# EAGLE design SH-SwitchNode-CT1 (EAGLE 7.2.0)
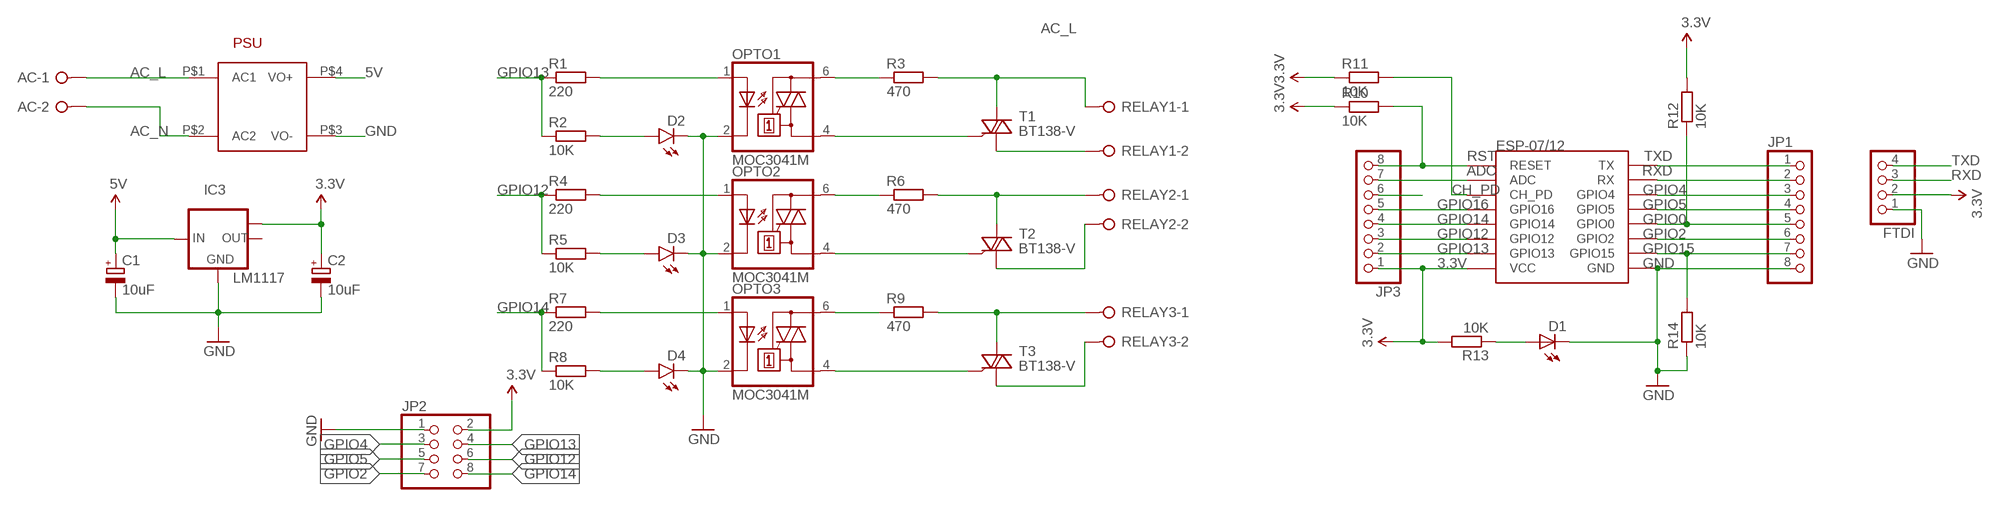
[diagram p0: schematic, sheet 1]

## Parts
AC  W237-02P  [W237-132]
C1  10uF  CPOL-EUB/3528-21W  [B/3528-21W]
C2  10uF  CPOL-EUB/3528-21W  [B/3528-21W]
D1  LEDCHIPLED_0805  [CHIPLED_0805]
D2  LED3MM  [LED3MM]
D3  LED3MM  [LED3MM]
D4  LED3MM  [LED3MM]
ESP-07/12  ESP12SMD  [ESP12-SMD]
FTDI  PINHD-1X4  [1X04]
IC3  LM1117  LM1117MPX-3.3  [SOT223]
JP1  PINHD-1X8  [1X08]
JP2  PINHD-2X4  [2X04]
JP3  PINHD-1X8  [1X08]
OPTO1  MOC3041M  [DIL06]
OPTO2  MOC3041M  [DIL06]
OPTO3  MOC3041M  [DIL06]
PSU  HLK-PM01  [HLK-PM01]
R1  220  R-EU_R0805  [R0805]
R2  10K  R-EU_R0805  [R0805]
R3  470  R-EU_R0805  [R0805]
R4  220  R-EU_R0805  [R0805]
R5  10K  R-EU_R0805  [R0805]
R6  470  R-EU_R0805  [R0805]
R7  220  R-EU_R0805  [R0805]
R8  10K  R-EU_R0805  [R0805]
R9  470  R-EU_R0805  [R0805]
R10  10K  R-EU_R0805  [R0805]
R11  10K  R-EU_R0805  [R0805]
R12  10K  R-EU_R0805  [R0805]
R13  10K  R-EU_R0805  [R0805]
R14  10K  R-EU_R0805  [R0805]
RELAY1  W237-02P  [W237-132]
RELAY2  W237-02P  [W237-132]
RELAY3  W237-02P  [W237-132]
T1  BT138-V  [TO220BV]
T2  BT138-V  [TO220BV]
T3  BT138-V  [TO220BV]

## Nets
3.3V: C2.+ ESP-07/12.VCC FTDI.2 IC3.TAB(OUT1) JP2.2 JP3.1 R10.1 R11.1 R12.2 R13.2
5V: C1.+ IC3.3(IN) PSU.P$4(VO+)
AC_L: AC.1 PSU.P$1(AC1) R3.2 R6.2 R9.2 RELAY1.1 RELAY2.1 RELAY3.1 T1.T2(A2) T2.T2(A2) T3.T2(A2)
AC_N: AC.2 PSU.P$2(AC2)
ADC: ESP-07/12.ADC JP3.7
CH_PD: ESP-07/12.CH_PD JP3.6 R11.2
GND: C1.- C2.- D1.C D2.K(C) D3.K(C) D4.K(C) ESP-07/12.GND FTDI.1 IC3.1(GND) JP1.8 JP2.1 OPTO1.2(C) OPTO2.2(C) OPTO3.2(C) PSU.P$3(VO-) R14.1
GPIO0: ESP-07/12.GPIO0 JP1.5 R12.1
GPIO2: ESP-07/12.GPIO2 JP1.6 JP2.7
GPIO4: ESP-07/12.GPIO4 JP1.3 JP2.3
GPIO5: ESP-07/12.GPIO5 JP1.4 JP2.5
GPIO12: ESP-07/12.GPIO12 JP2.6 JP3.3 R4.1 R5.1
GPIO13: ESP-07/12.GPIO13 JP2.4 JP3.2 R1.1 R2.1
GPIO14: ESP-07/12.GPIO14 JP2.8 JP3.4 R7.1 R8.1
GPIO15: ESP-07/12.GPIO15 JP1.7 R14.2
GPIO16: ESP-07/12.GPIO16 JP3.5
N$1: OPTO1.1(A) R1.2
N$4: OPTO1.6(A2) R3.1
N$6: OPTO2.1(A) R4.2
N$7: D3.A R5.2
N$9: OPTO2.6(A2) R6.1
N$10: OPTO1.4(A1) T1.G
N$11: OPTO2.4(A1) T2.G
N$12: OPTO3.1(A) R7.2
N$13: D4.A R8.2
N$14: RELAY2.2 T2.T1(A1)
N$15: OPTO3.6(A2) R9.1
N$16: OPTO3.4(A1) T3.G
N$17: RELAY3.2 T3.T1(A1)
N$18: D2.A R2.2
N$19: RELAY1.2 T1.T1(A1)
N$25: D1.A R13.1
RST: ESP-07/12.RESET JP3.8 R10.2
RXD: ESP-07/12.RXD0(RX) FTDI.3 JP1.2
TXD: ESP-07/12.TXD0(TX) FTDI.4 JP1.1
Unconnected: IC3.2(OUT)

## Library data of the parts
AC RELAY1-RELAY3 = con-wago-508:W237-02P: WAGO SREW CLAMP; OC_FARNELL: unknown; OC_NEWARK: unknown
C1 C2 = rcl:CPOL-EU: POLARIZED CAPACITOR, European symbol
D1 = adafruit:LED: LED OSRAM: - CHIPLED LG R971, LG N971, LY N971, LG Q971, LY Q971, LO R971, LY R971 LH N974, LH R974 LS Q976, LO Q976, LY Q976 LO Q996 - Hyper CHIPLED LW Q18S LB Q993, LB Q99A, LB R99A - SideLED LS A670, LO A670, LY A670, LG A670, LP A670 LB A673, LV A673, LT A673, LW A673 LH A674 LY A675 LS A676, LA A676, LO A676, LY A676, LW A676 LS A679, LY A679, LG A679 - Hyper Micro SIDELED® LS Y876, LA Y876, LO Y876, LY Y876 LT Y87S - SmartLED LW L88C, LW L88S LB L89C, LB L89S, LG L890 LS L89K, LO L89K, LY L89K LS L896, LA L896, LO L896, LY L896 - TOPLED LS T670, LO T670, LY T670, LG T670, LP T670 LSG T670, LSP T670, LSY T670, LOP T670, LYG T670 LG T671, LOG T671, LSG T671 LB T673, LV T673, LT T673, LW T673 LH T674 LS T676, LA T676, LO T676, LY T676, LB T676, LH T676, LSB T676, LW T676 LB T67C, LV T67C, LT T67C, LS T67K, LO T67K, LY T67K, LW E67C LS E67B, LA E67B, LO E67B, LY E67B, LB E67C, LV E67C, LT E67C LW T67C LS T679, LY T679, LG T679 LS T770, LO T770, LY T770, LG T770, LP T770 LB T773, LV T773, LT T773, LW T773 LH T774 LS E675, LA E675, LY E675, LS T675 LS T776, LA T776, LO T776, LY T776, LB T776 LHGB T686 LT T68C, LB T68C - Hyper Mini TOPLED® LB M676 - Mini TOPLED Santana® LG M470 LS M47K, LO M47K, LY M47K Source: http://www.osram.convergy.de/
D2-D4 = SparkFun-LED:LED: LEDs Standard schematic elements and footprints for 5mm, 3mm, 1206, and 0603 sized LEDs. 5mm - Spark Fun Electronics SKU : COM-00529 (and others)
ESP-07/12 = esp8266modules:ESP12: ESP8266 Wifi module 12
FTDI = pinhead:PINHD-1X4: PIN HEADER
IC3 = lm1117:LM1117MPX-*
JP1 JP3 = pinhead:PINHD-1X8: PIN HEADER
JP2 = adafruit:PINHD-2X4: PIN HEADER
OPTO1-OPTO3 = optocoupler:MOC30*: 6-Pin DIP Zero-Cross Optoisolators Triac Driver Output (250/400 Volt Peak) Source: Data sheet <http://www.fairchildsemi.com/ds/MO/MOC3031M.pdf> The old path of data sheet not more available 2013-05-06.; MF: FAIRCHILD SEMICONDUCTOR; MPN: MOC3041M; OC_FARNELL: 1086677; OC_NEWARK: 78K6090
PSU = HLK-PM01-Exported:HLK-PM01: HI-LINK Ultra-compact power module HLK-PM01 Meet UL, CE requirements Ultra-thin, ultra-small All voltage input (AC: 90 ~ 264V) Low ripple and low noise Output overload and short circuit protection High efficiency, high power density The product is designed to meet the requirements of EMC and Safety Test Low power consumption, environmental protection, no-load loss <0.1W 100% load aging and testing
R1-R14 = rcl:R-EU_: RESISTOR, European symbol
T1-T3 = triac:BT138: TRIAC Source: http://www.semiconductors.philips.com BT138_SERIES_2.pdf

## Board
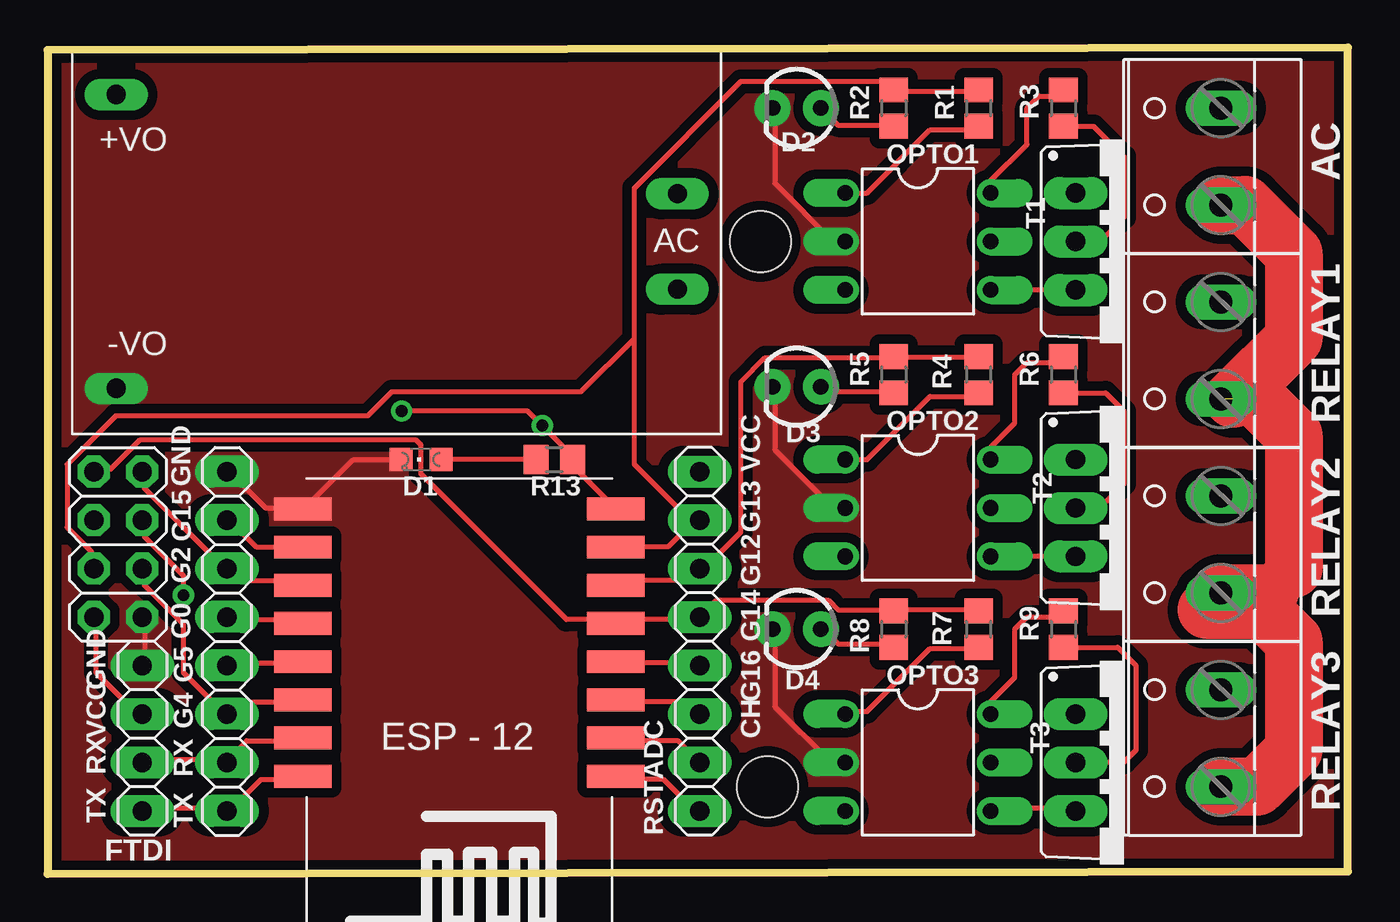
[diagram p1: board, top side]
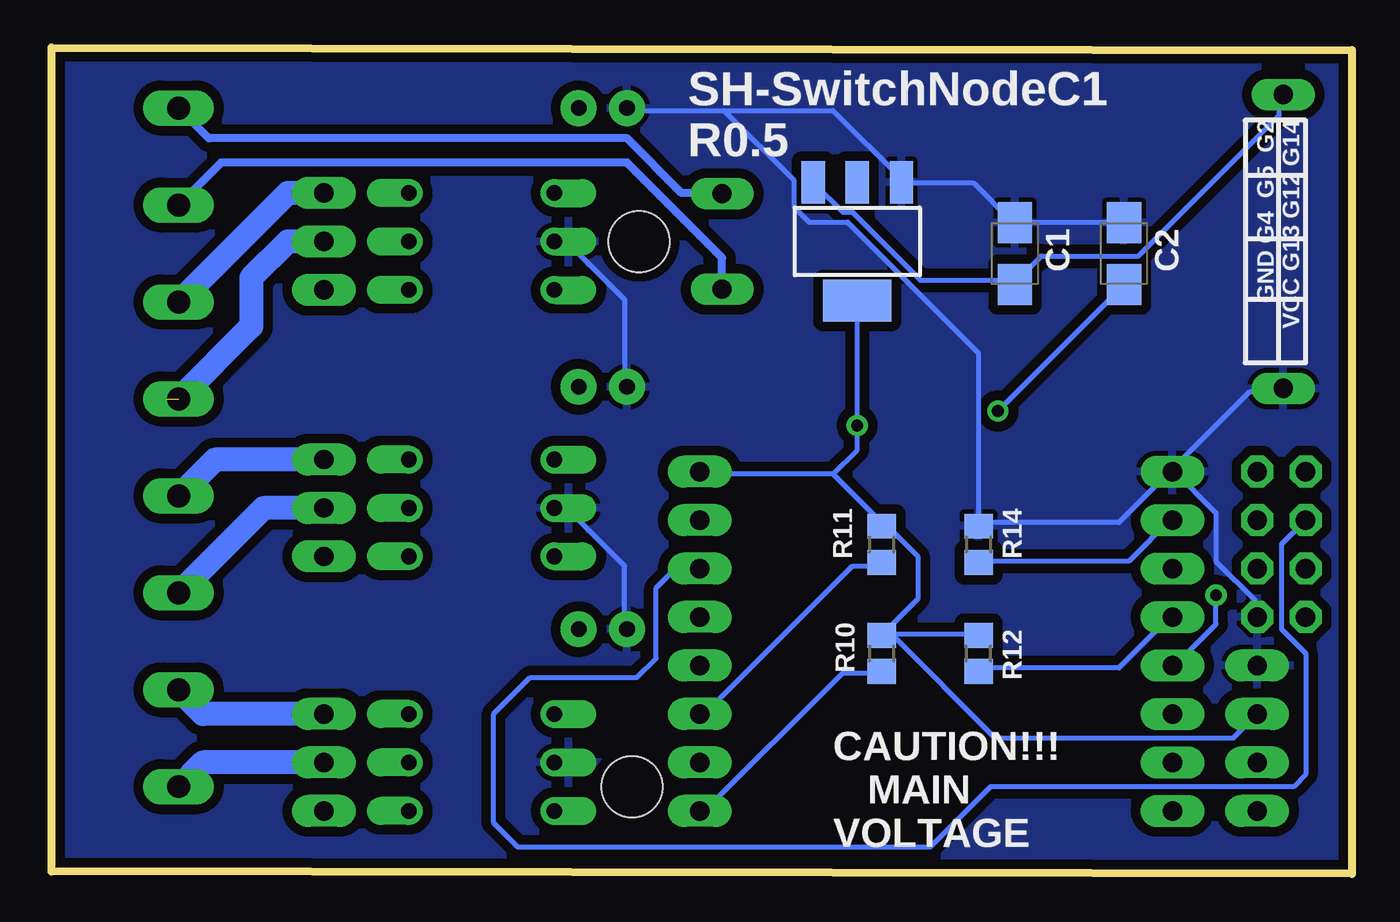
[diagram p2: board, bottom side, seen from below]

Size 68.12 x 43.3 mm. Coordinates in mm from the lower left corner, seen from the top.
Outline: 0,0 68.12,0.13 68.12,43.3 0,43.17 0,0
Copper layers (1*16): Top 0.035mm / dielectric 1.5mm / Bottom 0.035mm
Design rules "default *": minimum track width 10mil, minimum drill 24mil, track to track 10mil, track to pad 10mil, pad to pad 10mil, via to via 10mil, smd to smd 8mil, copper to edge 20mil, drill to drill 12mil, minimum pad ring 13mil, minimum via ring 10mil, stop-mask expansion 4mil, vias tented up to drill 0mil, thermal gap 10mil
Holes 3.2 mm at 37.34,33.15 37.72,4.57

### Footprints (pad centres in the part's own frame; a part is rotated, then mirrored left to right if it is on the bottom)
W237-132 = drill 1.194 long: 1 -2.54,-0.635; 2 2.54,-0.635
B/3528-21W = smd 2.15 x 1.8: + 1.625,0; - -1.625,0
CHIPLED_0805 = smd 1.2 x 1.2: A 0,-1.05; C 0,1.05
LED3MM = drill 0.813 pad 1.88: A -1.27,0; K 1.27,0
ESP12-SMD = smd 3 x 1.2: ADC -8.3,3.8; CH_PD -8.3,1.8; GND 8.1,-8.2; GPIO0 8.1,-2.2; GPIO2 8.1,-4.2; GPIO4 8.1,1.8; GPIO5 8.1,-0.2; GPIO12 -8.3,-4.2; GPIO13 -8.3,-6.2; GPIO14 -8.3,-2.2; GPIO15 8.1,-6.2; GPIO16 -8.3,-0.2; RESET -8.3,5.8; RXD0 8.1,3.8; TXD0 8.1,5.8; VCC -8.3,-8.2
1X04 = drill 1.016 long: 1 -3.81,0; 2 -1.27,0; 3 1.27,0; 4 3.81,0
SOT223 = smd 1.219 x 2.235: 1 -2.311,-3.099; 2 0,-3.099; 3 2.311,-3.099 | smd 3.6 x 2.2: TAB 0,3.099
1X08 = drill 1.016 long: 1 -8.89,0; 2 -6.35,0; 3 -3.81,0; 4 -1.27,0; 5 1.27,0; 6 3.81,0; 7 6.35,0; 8 8.89,0
2X04 = drill 1.016 pad 1.676 octagon: 1 -3.81,-1.27; 2 -3.81,1.27; 3 -1.27,-1.27; 4 -1.27,1.27; 5 1.27,-1.27; 6 1.27,1.27; 7 3.81,-1.27; 8 3.81,1.27
DIL06 = drill 0.813 offset: 1 -2.54,-3.81; 2 0,-3.81; 3 2.54,-3.81; 4 2.54,3.81; 5 0,3.81; 6 -2.54,3.81
HLK-PM01 = drill 1 long: P$1 -14.7,2.5; P$2 -14.7,-2.5; P$3 14.7,7.7; P$4 14.7,-7.7
R0805 = smd 1.3 x 1.5: 1 -0.95,0; 2 0.95,0
TO220BV = drill 1.016 long: G 2.54,-2.54; T1 -2.54,-2.54; T2 0,-2.54

### Placement (x,y rotation side)
AC  60.83,37.59 90 top
C1  17.65,32.51 270 bottom
C2  11.94,32.51 270 bottom
D1  19.56,21.72 90 top
D2  39.24,40.13 180 top
D3  39.24,25.53 180 top
D4  39.24,12.83 180 top
ESP-07/12  21.46,10.92 180 top
FTDI  4.95,7.11 270 top
IC3  25.91,33.15 180 bottom
JP1  9.4,12.19 90 top
JP2  3.68,17.27 90 top
JP3  34.16,12.19 270 top
OPTO1  45.59,33.15 270 top
OPTO2  45.59,19.18 270 top
OPTO3  45.59,5.84 270 top
PSU  18.29,33.15 180 top
R1  48.77,40.13 270 top
R2  44.32,40.13 270 top
R3  53.21,40.13 270 top
R4  48.77,26.16 270 top
R5  44.32,26.16 270 top
R6  53.21,26.16 270 top
R7  48.77,12.83 270 top
R8  44.32,12.83 270 top
R9  53.21,12.83 270 top
R10  24.64,11.56 270 bottom
R11  24.64,17.27 270 bottom
R12  19.56,11.56 90 bottom
R13  26.54,21.72 0 top
R14  19.56,17.27 270 bottom
RELAY1  60.83,27.43 90 top
RELAY2  60.83,17.27 90 top
RELAY3  60.83,7.11 90 top
T1  56.39,33.15 270 top
T2  56.39,19.18 270 top
T3  56.39,5.84 270 top

### Tracks (layer width: path | path; a pad name or v marks a point on that pad's centre or on a via)
3.3V  (via drill 0.61)
  Top 0.254: 27.69,21.72 27.69,21.21 29.72,19.18 ESP-07/12.VCC | v18.54,24.26 25.15,24.26 v25.91,23.49 27.69,21.72 | 27.69,21.72 R13.2 | JP2.2 2.54,13.34 2.54,10.54 4.83,8.26 FTDI.2
  Bottom 0.254: v18.54,24.26 11.94,30.86 C2.+ | 24.13,12.57 24.64,12.57 R10.1 22.73,14.41 22.73,16.64 24.26,18.16 24.64,18.16 R11.1 24.64,18.41 27.18,20.95 | 24.13,12.57 19.56,12.57 R12.2 | 27.18,20.95 34.04,20.95 JP3.1 | IC3.TAB v25.91,23.49 25.91,22.23 27.18,20.95 | FTDI.2 6.22,7.11 18.67,7.11 24.13,12.57
5V
  Bottom 0.254: IC3.3 28.19,36.2 26.67,34.67 26.16,34.67 22.61,31.12 17.78,31.12 C1.+ 17.53,31.12 16.26,32.38 11.18,32.38 3.81,39.75 3.81,40.77 PSU.P$4
AC_L  (1 unrouted)
  Top 0.254: R6.2 55.43,25.21 56.39,24.26 56.39,20.45 55.43,19.49 54.17,19.49 T2.T2 | R9.2 56.07,11.88 57.02,10.92 57.02,6.48 56.39,5.84 T3.T2 | R3.2 54.8,39.18 56.39,37.59 56.39,34.42 55.12,33.15 T1.T2 | 61.47,14.6 60.71,13.84 RELAY2.1 61.47,14.6
  Top 2.54: 62.1,24.89 63.37,24.89 | 64.01,14.73 65.28,16
  Top 3.048: AC.1 62.74,35.05 65.28,32.51 65.28,28.07 62.1,24.89 | 63.37,24.89 65.28,22.99 65.28,16 | 60.71,13.84 63.63,13.84 65.28,12.19 65.28,6.48 63.37,4.57 RELAY3.1 | RELAY2.1 64.01,14.73
  Bottom 0.406: PSU.P$1 32.99,32.29 37.97,37.27 59.24,37.27 AC.1
  Bottom 1.27: T1.T2 55.75,33.15 57.66,31.24 57.66,28.7 RELAY1.1 | T2.T2 57.02,19.18 RELAY2.1 | T3.T2 60.2,5.84 RELAY3.1
AC_N
  Bottom 0.254: 33.02,35.69 PSU.P$2
  Bottom 0.406: 33.02,35.69 35.12,35.69 37.97,38.54 59.88,38.54 AC.2
ADC
  Top 0.254: JP3.7 33.02,6.98 29.97,6.98 ESP-07/12.ADC
CH_PD
  Top 0.254: JP3.6 33.53,9.02 29.97,9.02 ESP-07/12.CH_PD
  Bottom 0.254: R11.2 24.64,16.13 26.16,16.13 34.04,8.26 JP3.6
GND
  Top 0.254: D1.C 16,21.72 13.46,19.18 ESP-07/12.GND 13.21,19.18 11.43,19.18 9.4,21.21 JP1.8 | FTDI.1 5.08,11.05 5.08,13.34 JP2.1 | OPTO2.2 41.15,19.18 38.1,22.23 38.1,25.53 D3.K | OPTO3.2 41.66,5.97 40.89,5.97 38.1,8.76 38.1,12.83 D4.K | OPTO1.2 41.15,33.15 38.1,36.2 38.1,40.01 D2.K
  Bottom 0.254: 19.56,18.41 12.19,18.41 9.4,21.21 | 9.4,21.21 5.33,25.27 3.81,25.27 PSU.P$3 | 9.4,21.21 7.11,18.92 7.11,16.38 5.08,14.35 5.08,13.59 JP2.1 | 9.4,21.21 JP1.8 | OPTO2.2 41.15,19.18 38.1,16.13 38.1,12.83 D4.K | C2.- 11.94,34.16 17.53,34.16 C1.- 17.78,34.16 19.81,36.2 23.37,36.2 IC3.1 23.62,36.45 27.18,40.01 32.89,40.01 | 32.89,40.01 37.85,40.01 D2.K | OPTO1.2 41.15,33.15 38.1,30.1 38.1,25.53 D3.K | 19.56,18.41 19.56,27.3 26.42,34.16 28.45,34.16 29.21,34.93 29.21,36.32 32.89,40.01 | 19.56,18.41 R14.1
  pour Bottom (isolate 0.508): -3.94,46.48 72.9,46.48 72.9,-4.32 -3.94,-4.32
  pour Top (isolate 0.508, no thermals): -3.94,46.48 72.9,46.48 72.9,-4.32 -3.94,-4.32
GPIO0
  Top 0.254: ESP-07/12.GPIO0 13.21,13.34 9.4,13.34 JP1.5
  Bottom 0.254: R12.1 19.56,10.8 12.19,10.8 9.4,13.59 JP1.5
GPIO2
  Top 0.254: 9.4,15.88 9.91,15.37 13.21,15.37 ESP-07/12.GPIO2 | 9.4,15.88 5.08,20.19 5.08,20.95 JP2.7 | 9.4,15.88 JP1.6
GPIO4
  Top 0.254: ESP-07/12.GPIO4 13.21,9.02 9.91,9.02 9.4,8.51 JP1.3 9.4,8.26 7.11,10.54 7.11,13.08 5.08,15.11 5.08,15.88 JP2.3
GPIO5  (via drill 0.61)
  Top 0.254: ESP-07/12.GPIO5 13.21,11.05 9.4,11.05 JP1.4 | v7.11,14.6 7.11,15.62 5.08,17.65 5.08,18.41 JP2.5
  Bottom 0.254: v7.11,14.6 7.11,13.08 9.4,10.8 JP1.4
GPIO12
  Top 0.254: R4.1 48.77,27.05 44.45,27.05 R5.1 44.2,27.05 37.59,27.05 36.32,25.78 36.32,17.91 34.29,15.88 JP3.3 33.53,15.37 29.97,15.37 ESP-07/12.GPIO12
  Bottom 0.254: JP2.6 3.68,17.27 3.68,12.83 2.41,11.56 2.41,5.21 3.05,4.57 18.92,4.57 22.1,1.4 43.69,1.4 44.96,2.67 44.96,8.38 43.05,10.29 37.47,10.29 36.45,11.3 36.45,14.99 35.43,16 JP3.3
GPIO13
  Top 0.254: R1.1 48.77,41.02 44.45,41.02 R2.1 | 33.78,18.41 34.04,18.67 JP3.2 33.78,18.41 | 33.78,18.41 32.51,17.15 29.97,17.15 ESP-07/12.GPIO13 | 30.73,28.07 30.73,21.46 33.78,18.41 | 30.73,28.07 30.73,35.94 36.32,41.53 43.88,41.53 R2.1 | 44.2,41.27 R2.1 | JP2.4 2.29,16.13 2.29,16.89 1.02,18.16 1.02,21.46 3.56,24 16.76,24 18.03,25.27 27.94,25.27 30.73,28.07
GPIO14
  Top 0.254: R7.1 48.77,13.84 44.45,13.84 R8.1 44.2,13.84 41.4,13.84 40.89,14.35 35.05,14.35 JP3.4 34.04,13.34 29.97,13.34 ESP-07/12.GPIO14 29.72,13.34 27.18,13.34 19.56,20.95 19.56,22.48 19.3,22.73 4.83,22.73 3.3,21.21 2.54,21.21 JP2.8
GPIO15
  Top 0.254: ESP-07/12.GPIO15 13.21,17.15 10.92,17.15 9.4,18.67 JP1.7
  Bottom 0.254: R14.2 19.56,16.38 11.68,16.38 9.4,18.67 JP1.7
GPIO16
  Top 0.254: ESP-07/12.GPIO16 29.97,11.05 34.04,11.05 JP3.5
N$1
  Top 0.254: OPTO1.1 42.93,35.69 46.23,38.99 48.77,38.99 R1.2
N$4
  Top 0.254: OPTO1.6 49.4,36.32 51.31,38.23 51.31,40.13 51.94,40.77 52.9,40.77 R3.1
N$6
  Top 0.254: OPTO2.1 42.93,21.72 46.23,25.02 48.77,25.02 R4.2
N$7
  Top 0.254: R5.2 44.2,25.27 40.89,25.27 40.64,25.53 D3.A
N$9
  Top 0.254: OPTO2.6 49.4,22.35 50.67,23.62 50.67,26.16 51.31,26.8 52.9,26.8 R6.1
N$10
  Top 0.254: T1.G OPTO1.4
N$11
  Top 0.254: T2.G OPTO2.4
N$12
  Top 0.254: R7.2 48.77,11.81 46.23,11.81 42.93,8.51 41.91,8.51 OPTO3.1
N$13
  Top 0.254: R8.2 44.2,12.06 41.4,12.06 40.64,12.83 D4.A
N$14
  Top 0.254: 61.47,19.94 RELAY2.2
  Bottom 1.27: T2.T1 59.56,21.72 RELAY2.2
N$15
  Top 0.254: OPTO3.6 49.4,9.02 50.67,10.29 50.67,12.83 51.31,13.46 52.9,13.46 R9.1
N$16
  Top 0.254: OPTO3.4 49.53,3.43 53.85,3.43 T3.G
N$17
  Bottom 1.27: T3.T1 60.2,8.38 RELAY3.2
N$18
  Top 0.254: D2.A 41.4,39.24 44.2,39.24 R2.2
N$19
  Bottom 1.27: T1.T1 55.75,35.69 RELAY1.2
N$25
  Top 0.254: R13.1 D1.A
RST
  Top 0.254: ESP-07/12.RESET 29.97,4.95 32.26,4.95 34.04,3.17 JP3.8
  Bottom 0.254: R10.2 24.64,10.54 26.67,10.54 34.04,3.17 JP3.8
RXD
  Top 0.254: 9.4,5.97 10.41,6.98 13.21,6.98 ESP-07/12.RXD0 | 9.4,5.97 5.08,5.97 FTDI.3 | 9.4,5.97 JP1.2
TXD
  Top 0.254: ESP-07/12.TXD0 13.21,4.95 11.18,4.95 9.4,3.17 JP1.1 9.4,3.43 5.08,3.43 FTDI.4

### Text on the board
tNames: VCC | GND | G15 | G13 | G2 | G12 | G0 | G14 | GND | G5 | G16 | VCC | G4 | CH | RX | RX | ADC | TX | TX | RST
bNames: GND G4 G5 G2 / VCC G13 G12 G14 | SH-SwitchNodeC1 / R0.5 | CAUTION!!! / MAIN / VOLTAGE